# Altium schematic sheet polishing_machinie.SchDoc
size A4; SheetNumber: 1; SheetTotal: 1
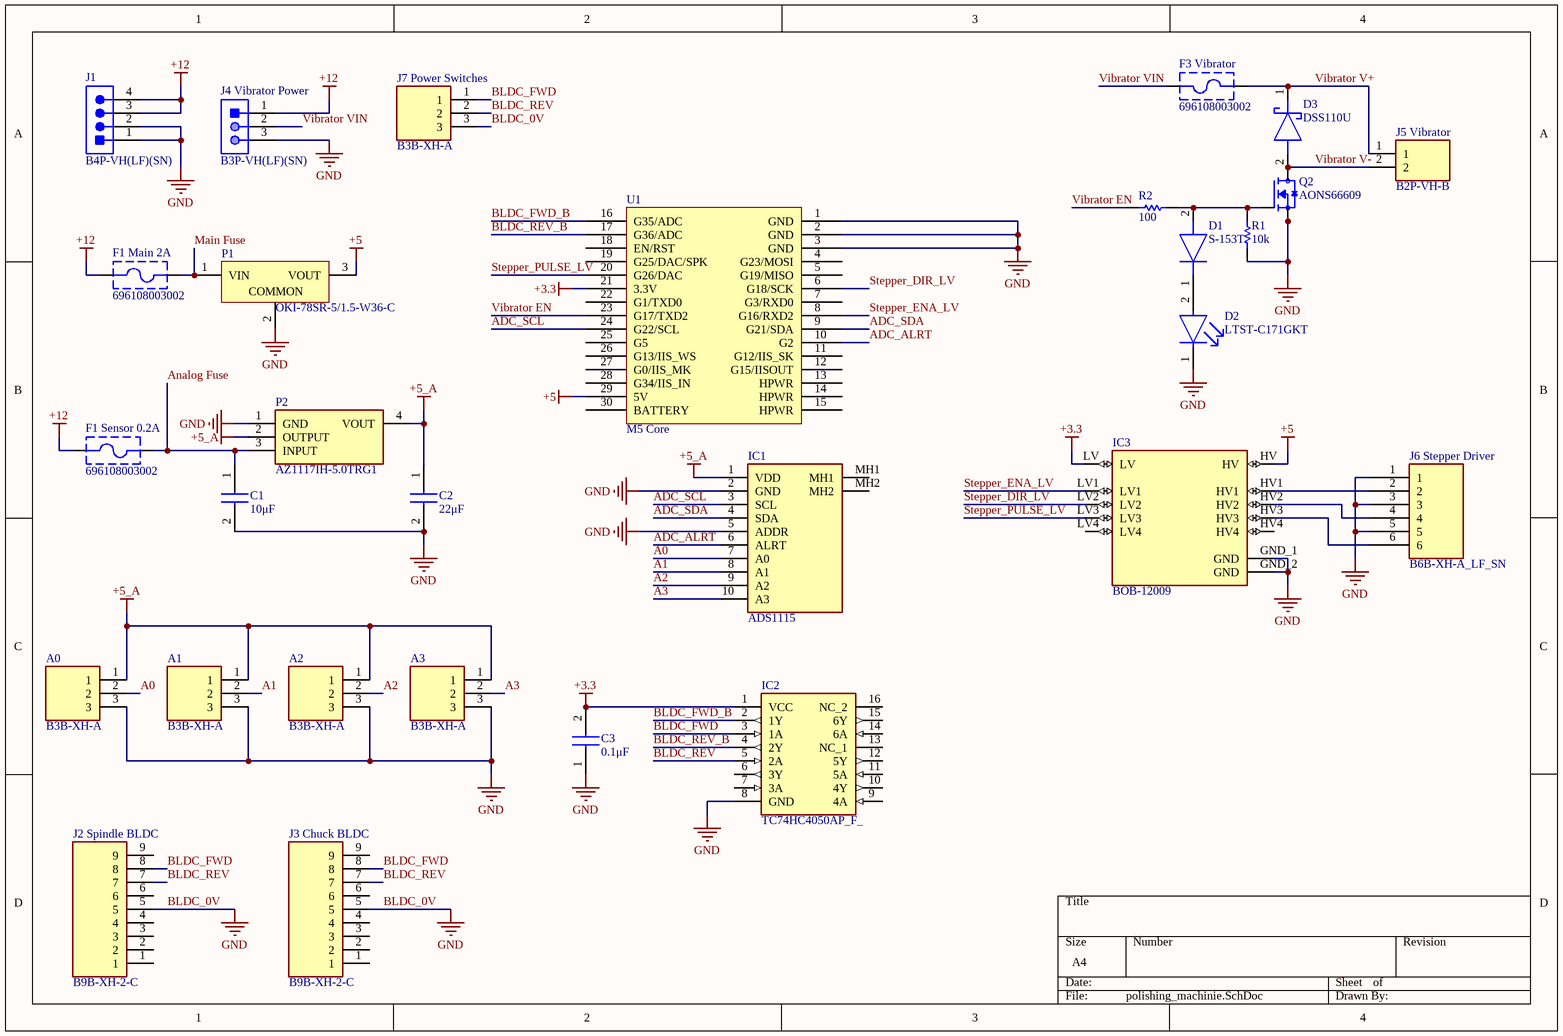
[diagram p0: polishing_machinie.SchDoc]

## Parts
A0  B3B-XH-A  [SHDR3W64P0X250_1X3_990X575X700P]
A1  B3B-XH-A  [SHDR3W64P0X250_1X3_990X575X700P]
A2  B3B-XH-A  [SHDR3W64P0X250_1X3_990X575X700P]
A3  B3B-XH-A  [SHDR3W64P0X250_1X3_990X575X700P]
C1  10μF  [CAPC2012X95N]
C2  22μF  [CAPC2012X95N]
C3  0.1μF  [CAPC2012X70N]
D1  S-153T  [SODFL3516X70N]
D2  LTST-C171GKT  [FP-LTST-C171GKT-MFG]
D3  DSS110U  [DSS110U]
F1_Main_2A  696108003002  [696108003002]
F1_Sensor_0.2A  696108003002  [696108003002]
F3_Vibrator  696108003002  [696108003002]
IC1  ADS1115  [ADS1115]
IC2  TC74HC4050AP_F_  [DIP762W60P254L1975H445Q16N]
IC3  BOB-12009  [CONV_BOB-12009]
J1  B4P-VH(LF)(SN)  [JST-B4P-VH(LF)(SN)_V]
J2_Spindle_BLDC  B9B-XH-2-C  [SHDR9W64P0X250_1X9_2490X575X700P]
J3_Chuck_BLDC  B9B-XH-2-C  [SHDR9W64P0X250_1X9_2490X575X700P]
J4_Vibrator_Power  B3P-VH(LF)(SN)  [JST-B3P-VH(LF)(SN)-3_V]
J5_Vibrator  B2P-VH-B  [B2PVHB]
J6_Stepper_Driver  B6B-XH-A_LF_SN  [FP-B6B-XH-A_LF_SN-MFG]
J7_Power_Switches  B3B-XH-A  [SHDR3W64P0X250_1X3_990X575X700P]
P1  OKI-78SR-5/1.5-W36-C  [MURA-OKI-78SR-3]
P2  AZ1117IH-5.0TRG1  [SOT230P700X180-4N]
Q2  AONS66609  [AONS66609]
R1  10k  [RESC2013X60X40LL20T25_A]
R2  100  [RESC2013X60X40ML20T25]
U1  M5 Core  [M5 Core]

## Nets
+3.3: C3.2 IC2.1(VCC) IC3.LV U1.21(3.3V)
+5: IC3.HV P1.3(VOUT) U1.29(5V)
+5_A: A0.1 A1.1 A2.1 A3.1 C2.1 IC1.1(VDD) P2.2(OUTPUT) P2.4(VOUT)
+12: F1_Main_2A.1 F1_Sensor_0.2A.1 J1.3 J1.4 J4_Vibrator_Power.1
BLDC_0V: A0.3 A1.3 A2.3 A3.3 C1.2 C2.2 C3.1 D2.1(C) IC1.2(GND) IC1.5(ADDR) IC2.8(GND) IC3.GND_1(GND) IC3.GND_2(GND) J1.1 J1.2 J2_Spindle_BLDC.5 J3_Chuck_BLDC.5 J4_Vibrator_Power.3 J6_Stepper_Driver.1 J6_Stepper_Driver.3 J6_Stepper_Driver.5 J7_Power_Switches.3 P1.2(COMMON) P2.1(GND) Q2.1(S) Q2.2(S) Q2.3(S) R1.1 U1.1(GND) U1.2(GND) U1.3(GND)  [also labelled GND]
A0: A0.2 IC1.7(A0)
A1: A1.2 IC1.8(A1)
A2: A2.2 IC1.9(A2)
A3: A3.2 IC1.10(A3)
ADC_ALRT: IC1.6(ALRT) U1.10(G2)
ADC_SCL: IC1.3(SCL) U1.24(G22/SCL)
ADC_SDA: IC1.4(SDA) U1.9(G21/SDA)
Analog Fuse: C1.1 F1_Sensor_0.2A.2 P2.3(INPUT)
BLDC_FWD: IC2.3(1A) J2_Spindle_BLDC.8 J3_Chuck_BLDC.8 J7_Power_Switches.1
BLDC_FWD_B: IC2.2(1Y) U1.16(G35/ADC)
BLDC_REV: IC2.5(2A) J2_Spindle_BLDC.7 J3_Chuck_BLDC.7 J7_Power_Switches.2
BLDC_REV_B: IC2.4(2Y) U1.17(G36/ADC)
Main Fuse: F1_Main_2A.2 P1.1(VIN)
Stepper_DIR_LV: IC3.LV2 U1.6(G18/SCK)
Stepper_ENA_LV: IC3.LV1 U1.8(G16/RXD2)
Stepper_PULSE_LV: IC3.LV3 U1.20(G26/DAC)
Vibrator EN: R2.1 U1.23(G17/TXD2)
Vibrator V+: D3.1(K) F3_Vibrator.2 J5_Vibrator.1
Vibrator V-: D3.2(A) J5_Vibrator.2 Q2.5_8(D)
Vibrator VIN: F3_Vibrator.1 J4_Vibrator_Power.2
NetD1_1: D1.1(K) D2.2(A)
NetD1_2: D1.2(A) Q2.4(G) R1.2 R2.2
NetIC3_HV1: IC3.HV1 J6_Stepper_Driver.2
NetIC3_HV2: IC3.HV2 J6_Stepper_Driver.4
NetIC3_HV3: IC3.HV3 J6_Stepper_Driver.6

Not connected (* = marked no-connect by the designer): IC1 MH1 MH2; IC2 6(3Y) 7(3A) 9(4A) 10(4Y) 11(5A) 12(5Y) 13(NC_1) 14(6A) 15(6Y) 16(NC_2); IC3 HV4 LV4; J2_Spindle_BLDC 1 2 3 4 6 9; J3_Chuck_BLDC 1 2 3 4 6 9; U1 4(G23/MOSI) 5(G19/MISO) 7(G3/RXD0) 11(G12/IIS_SK) 12(G15/IISOUT) 13(HPWR) 14(HPWR) 15(HPWR) 18(EN/RST) 19(G25/DAC/SPK) 22(G1/TXD0) 25(G5) 26(G13/IIS_WS) 27(G0/IIS_MK) 28(G34/IIS_IN) 30(BATTERY)

## Library data of the parts
A0-A3 J7_Power_Switches = B3B-XH-A: Connector; Manufacturer_Name: JST (JAPAN SOLDERLESS TERMINALS); Datasheet Link: http://www.jst-mfg.com/product/pdf/eng/eXH.pdf; Height: 7mm; Manufacturer_Part_Number: B3B-XH-A
C1 = GRM219B31C106KA73D: Capacitor; Manufacturer_Name: Murata Electronics; Datasheet Link: http://www.murata.com/~/media/webrenewal/support/library/catalog/products/capacitor/mlcc/c02e.pdf; Height: 0.95mm; Manufacturer_Part_Number: GRM219B31C106KA73D; Mouser Part Number: N/A; Mouser Price/Stock: https://www.mouser.com/Search/Refine.aspx?Keyword=N%2FA
C2 = GRM219B31A226MEA0D: Capacitor; Manufacturer_Name: Murata Electronics; Datasheet Link: http://www.murata.com/~/media/webrenewal/support/library/catalog/products/capacitor/mlcc/c02e.pdf; Height: 0.95mm; Manufacturer_Part_Number: GRM219B31A226MEA0D
C3 = GRM216F51E104ZA01D: Capacitor; Manufacturer_Name: Murata Electronics; Datasheet Link: http://www.murata.com/~/media/webrenewal/support/library/catalog/products/capacitor/mlcc/c02e.pdf; Height: 0.7mm; Manufacturer_Part_Number: GRM216F51E104ZA01D; Mouser Part Number: 81-GRM40Y104Z25D; Mouser Price/Stock: https://www.mouser.co.uk/ProductDetail/Murata-Electronics/GRM216F51E104ZA01D?qs=duOfYTBEatk23Zc3Fu%2FfWg%3D%3D
D1 = S-153T: Diode; Manufacturer_Name: Semitec; Datasheet Link: https://componentsearchengine.com/Datasheets/1/S-153T.pdf; Height: 0.7mm; Manufacturer_Part_Number: S-153T; Mouser Part Number: 954-S-153T; Mouser Price/Stock: https://www.mouser.co.uk/ProductDetail/Semitec/S-153T?qs=wgO0AD0o1vvtOOXMab9S0Q%3D%3D
D2 = CMP-22017-000007-1: LED GREEN CLEAR CHIP SMD; Luminous Intensity: 12mcd; Lens Color: Colorless; Dominant Wavelength: 569nm; Number of LEDs: 1; Power Dissipation: 100mW; Viewing Angle: 130°; Reverse Voltage: 5V; Test Current: 10mA; Forward Voltage: 2.1V; Wavelength: 585nm; Lens Style: Diffused; Forward Current: 30mA; Height: 0.8mm; Mount: Surface Mount; Package Quantity: 1; Length: 2mm; Case Code (Metric): 2012; Number of Pins: 2; Number of Elements: 1; Packaging: Tape and Reel; Color: Green; Min Operating Temperature: -55°C; Case/Package: 0805; Power Rating: 100mW; Max Operating Temperature: 85°C; Radiation Hardening: No; Depth: 1.25mm; Lens Transparency: Clear; Width: 1.25mm; Lead Free: Lead Free; Case Code (Imperial): 0805; Illumination Color: Green
D3 = DSS110U: Schottky Diode; Manufacturer_Name: SANGDEST MICROELECTRONICS (NANJING) CO LTD; Datasheet Link: https://www.smc-diodes.com/propdf/DSS12U%20THRU%20DSS120U%20N1873%20REV.D.pdf; Height: 1.1mm; Manufacturer_Part_Number: DSS110U
F1_Main_2A F1_Sensor_0.2A F3_Vibrator = CMP-1502-00237-2: NexarPartId: 56808807; Voltage Rating (AC): 250V; Fuse Current: 10A; REACH SVHC: Unknown; RoHS: Non-Compliant; Mount: Through Hole; Packaging: Box
IC1 = ADS1115: Integrated Circuit; Manufacturer_Name: Adafruit; Datasheet Link: https://cdn-learn.adafruit.com/downloads/pdf/adafruit-4-channel-adc-breakouts.pdf; Height: 3.25mm; Manufacturer_Part_Number: ADS1115
IC2 = TC74HC4050AP_F_: Integrated Circuit; Manufacturer_Name: Toshiba; Manufacturer_Part_Number: TC74HC4050AP(F); Datasheet Link: http://toshiba.semicon-storage.com/ap-en/product/logic/cmos-logic/detail.TC74HC4050AP.html; Height: 4.45mm; Mouser Part Number: 757-TC74HC4050APF; Mouser Price/Stock: https://www.mouser.co.uk/ProductDetail/Toshiba/TC74HC4050APF?qs=6sMpW4eYgwPJdB5%252B3R4%2FxA%3D%3D
IC3 = BOB-12009: BSS138 Logic-Level Translator Interface Evaluation Board; MF: SparkFun; Price: None; MP: BOB-12009; Availability: Unavailable; SnapEDA_Link: https://www.snapeda.com/parts/BOB-12009/SparkFun%20Electronics/view-part/551764/?ref=snap; Value: *; Package: None
J1 = CMP-2000-05905-1: Male Header, Pitch 3.96 mm, 1 x 4 Position, Height 10.9 mm, Tail Length 3.7 mm, -25 to 85 degC, RoHS, Bulk; Manufacturer: JST; Pitch: 3.96mm; Style/Orientation: StraightHeader/Plug; No of Positions: 4; Termination: Solder; Package Description: Male Header, Pitch 3.96 mm, 1 x 4 Position, Height 10.9 mm, Tail Length 3.7 mm; Manufacturer URL: http://www.jst.com/home2.html; Datasheet Version: 05/2016; Mounting Technology: ThroughHole; Package Reference: B4P-VH(LF)(SN); Type: LockingHeader; Datasheet URL: http://www.jst-mfg.com/product/pdf/eng/eVH.pdf
J2_Spindle_BLDC J3_Chuck_BLDC = B9B-XH-2-C: Connector; Manufacturer_Name: JST (JAPAN SOLDERLESS TERMINALS); Height: 7mm; Manufacturer_Part_Number: B9B-XH-2-C
J4_Vibrator_Power = CMP-1755-00003-1: Male Header, Pitch 3.96 mm, 1 x 3 Position, Height 10.9 mm, Tail Length 3.7 mm, -25 to 85 degC, RoHS, Bulk; PackageReference: B3P-VH(LF)(SN); ComponentLink2Description: Datasheet; ComponentLink2URL: http://www.jst-mfg.com/product/pdf/eng/eVH.pdf; DatasheetVersion: May-16; PackageDescription: Male Header, Pitch 3.96 mm, 1 x 3 Position, Height 10.9 mm, Tail Length 3.7 mm; ComponentLink1URL: http://www.jst.com/home2.html; ComponentLink1Description: Manufacturer URL
J5_Vibrator = B2P-VH-B: Connector; Manufacturer_Name: JST (JAPAN SOLDERLESS TERMINALS); Datasheet Link: https://www.jst-mfg.com/product/pdf/eng/eVH.pdf; Height: 10.9mm; Manufacturer_Part_Number: B2P-VH-B
P1 = CMP-2000-05274-1: Non-Isolated DC/DC Converter, 7.5 W, 7 to 36 V, 1.5 A, -40 to 85 degC, 3-Pin THD, RoHS; Manufacturer: Murata; Current - Output (Max): 1.5A; Power (Watts) - Max: 8W; Efficiency: 90.5%; Voltage - Input (Min): 7V; Voltage - Input (Max): 36V; Voltage - Output 1: 5V; Number of Outputs: 1; Package / Case: 3-SIPModule; Features: SCP; Type: LinearRegulatorReplacement; Size / Dimension: 0.41"Lx0.30"Wx0.65"H(10.4mmx7.6mmx16.5mm); Datasheet URL: https://datasheet.ciiva.com/8006/1790439-8006672.pdf; Datasheet Version: Oct-13; Power (Watts) - Manufacture Series: 8W; Voltage - Output 2: -; Series: Okami™OKI-78SR; Family: DCDCConverters; Manufacturer URL: http://www.murata.com/; Category: PowerSupplies-BoardMount; Voltage - Isolation: -; Packaging: Tube; Applications: ITE(Commercial); Mounting Type: ThroughHole; Voltage - Output 3: -; Operating Temperature: -40degC~85degC
P2 = AZ1117IH-5.0TRG1: Integrated Circuit; Manufacturer_Name: Diodes Incorporated; Datasheet Link: https://www.diodes.com//assets/Datasheets/AZ1117I.pdf; Height: 1.8mm; Manufacturer_Part_Number: AZ1117IH-5.0TRG1; Mouser Part Number: 621-AZ1117IH-5.0TRG1; Mouser Price/Stock: https://www.mouser.co.uk/ProductDetail/Diodes-Incorporated/AZ1117IH-5.0TRG1?qs=cpo3%2FpBou2jpUVbxjr50ag%3D%3D; Arrow Part Number: AZ1117IH-5.0TRG1; Arrow Price/Stock: https://www.arrow.com/en/products/az1117ih-5.0trg1/diodes-incorporated?utm_currency=USD&region=europe
Q2 = AONS66609: N-Channel 60 V 10A (Ta), 51A (Tc) 3.1W (Ta), 83W (Tc) Surface Mount 8-PDFN (5.2x5.75); MF: Taiwan Semiconductor; MP: TSM130NB06LCR; SnapEDA_Link: https://www.snapeda.com/parts/TSM130NB06LCR/Taiwan+Semiconductor/view-part/?ref=snap; Package: PDFN56 Taiwan Semiconductor; Value: *; Check_prices: https://www.snapeda.com/parts/TSM130NB06LCR/Taiwan+Semiconductor/view-part/?ref=eda
R1 = CMP-2001-00582-2: Metal Film Chip Resistor, High Reliability Type, 0.125 W, +/- 0.1%, -55 to 155 degC, 0805 (2012 Metric), RoHS, Tape and Reel; Voltage Rating: 100V; Power Rating: 125mW(1/8W); Brand: Panasonic; Temperature Coefficient: 25PPM/C; Resistance: 10kOhms; Product Category: ThinFilmResistors-SMD; Datasheet Version: 02/2016; Operating Temperature Range: -55Cto+155C; Length: 2mm; Mounting Technology: SurfaceMount; Manufacturer URL: http://www.panasonic.com/; Width: 1.25mm; Packaging: Reel; Product: ThinFilmResistorsSMD; Package / Case: 0805(2012metric); Termination Style: SMD/SMT; Tolerance: 0.1%; Datasheet URL: https://industrial.panasonic.com/cdbs/www-data/pdf/RDM0000/AOA0000C307.pdf; Package Description: 2-Pin Surface Mount Device, Body 2 x 1.25 mm; Factory Pack Quantity: 5000; Series: ERA-6A; Case Code - mm: 2012; RoHS: Details; Package Reference: 0805; Height: 0.5mm; Manufacturer: Panasonic; Case Code - in: 0805; Type: MetalFilmChipResistors
R2 = CMP-2001-00580-1: Manufacturer: Panasonic; Part Number: ERA6AEB101V